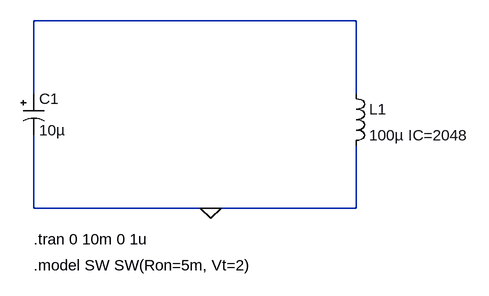
[diagram p0: schematic Superconducting-coilgun-1V00.asc]
Superconducting-coilgun-1V00.asc, the LTspice schematic file:
Version 4
SHEET 1 880 680
WIRE -272 -144 -768 -144
WIRE -768 -32 -768 -144
WIRE -272 -32 -272 -144
WIRE -768 144 -768 32
WIRE -496 144 -768 144
WIRE -272 144 -272 48
WIRE -272 144 -496 144
FLAG -496 144 0
SYMBOL polcap -784 -32 R0
WINDOW 3 24 56 Left 2
SYMATTR Value 10µ
SYMATTR InstName C1
SYMATTR SpiceLine V=63 Irms=900m Rser=0 Lser=0
SYMATTR Description Capacitor
SYMATTR Type cap
SYMBOL ind -288 -48 R0
SYMATTR InstName L1
SYMATTR Value 100µ IC=2048
SYMATTR SpiceLine Rser=1u
TEXT -768 192 Left 2 !.tran 0 10m 0 1u
TEXT -768 232 Left 2 !.model SW SW(Ron=5m, Vt=2)

The netlist it stands for:
* Superconducting-coilgun-1V00.asc
C1 N001 0 10µ V=63 Irms=900m Rser=0 Lser=0
L1 N001 0 100µ IC=2048 Rser=1u
.tran 0 10m 0 1u
.model SW SW(Ron=5m, Vt=2)
.backanno
.end